# Altium schematic sheet TMTGP_Sensors.SchDoc
size A
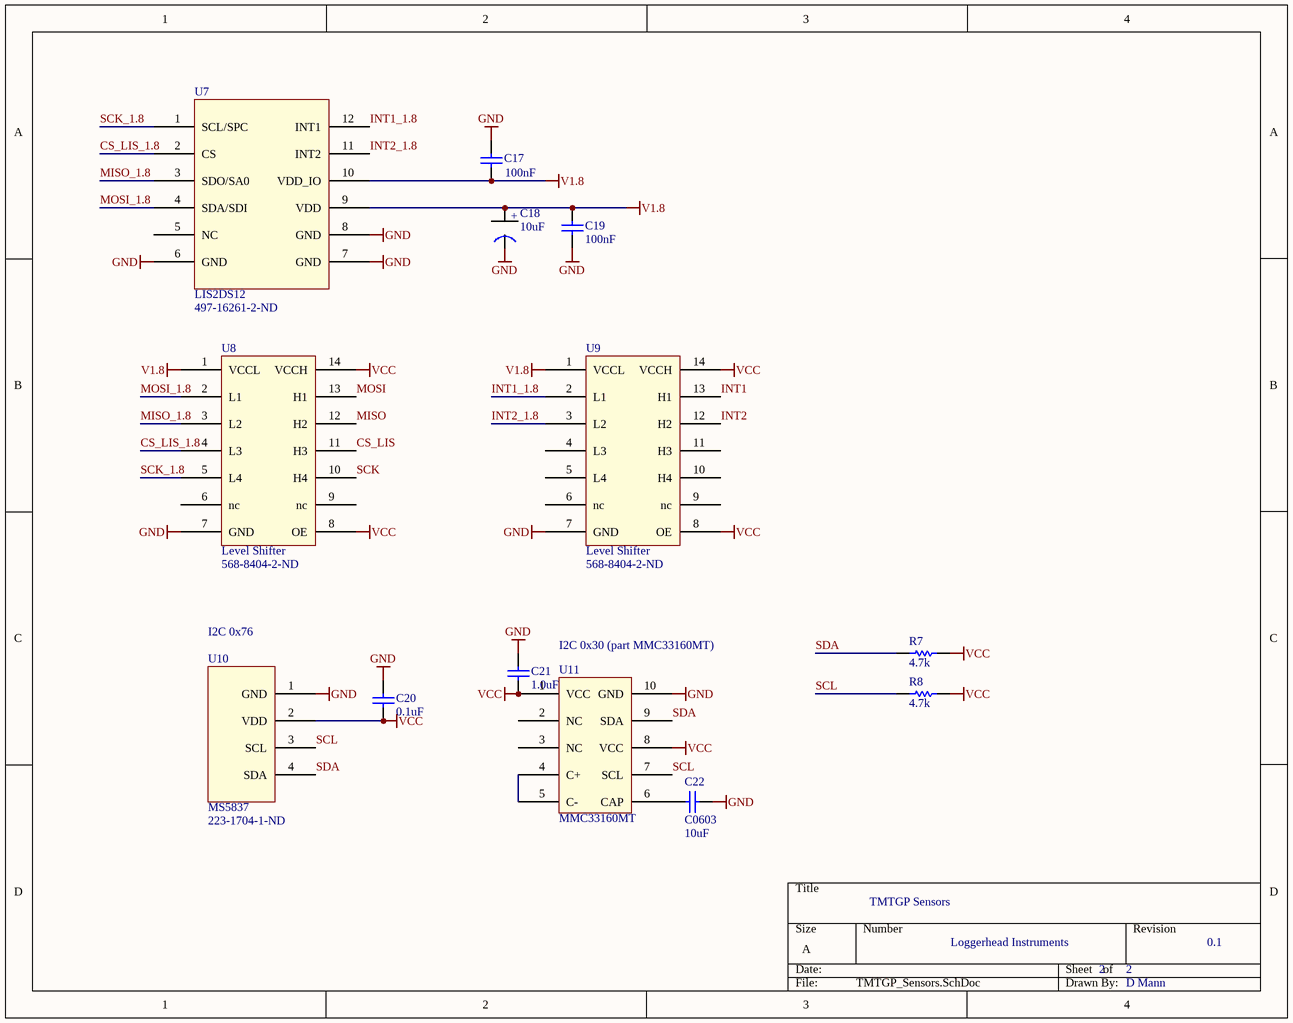
[diagram p0: TMTGP_Sensors.SchDoc]

## Parts
C17  100nF  [0402]
C18  10uF  [Tant0805]
C19  100nF  [0402]
C20  0.1uF  [0402]
C21  1.0uF  [0402]
C22  C0603  value 10uF  [0603]
R7  4.7k  [3-0603]
R8  4.7k  [3-0603]
U7  LIS2DS12  Supplier Part Number 1: 497-16261-2-ND  [LGA-12]
U8  Level Shifter  Supplier Part Number 1: 568-8404-2-ND  [DHVQFN14]
U9  Level Shifter  Supplier Part Number 1: 568-8404-2-ND  [DHVQFN14]
U10  MS5837  Supplier Part Number 1: 223-1704-1-ND  [MS5837]
U11  MMC33160MT  [MMC33160MT]

## Nets
GND: C17.2 C18.1(GND) C19.2 C20.2 C21.2 C22.1 U7.6(GND) U7.7(GND) U7.8(GND) U8.7(GND) U9.7(GND) U10.1(GND) U11.10(GND)
V1.8: C17.1 C18.2(+) C19.1 U7.9(VDD) U7.10(VDD_IO) U8.1(VCCL) U9.1(VCCL)
VCC: C20.1 C21.1 R7.1 R8.2 U8.8(OE) U8.14(VCCH) U9.8(OE) U9.14(VCCH) U10.2(VDD) U11.1(VCC) U11.8(VCC)
CS_LIS: U8.11(H3)
CS_LIS_1.8: U7.2(CS) U8.4(L3)
INT1: U9.13(H1)
INT1_1.8: U7.12(INT1) U9.2(L1)
INT2: U9.12(H2)
INT2_1.8: U7.11(INT2) U9.3(L2)
MISO: U8.12(H2)
MISO_1.8: U7.3(SDO/SA0) U8.3(L2)
MOSI: U8.13(H1)
MOSI_1.8: U7.4(SDA/SDI) U8.2(L1)
SCK: U8.10(H4)
SCK_1.8: U7.1(SCL/SPC) U8.5(L4)
SCL: R8.1 U10.3(SCL) U11.7(SCL)
SDA: R7.2 U10.4(SDA) U11.9(SDA)
NetC22_2: C22.2 U11.6(CAP)
NetU11_4: U11.4(C+) U11.5(C-)

Not connected (* = marked no-connect by the designer): U7 5(NC); U8 6(nc) 9(nc); U9 4(L3) 5(L4) 6(nc) 9(nc) 10(H4) 11(H3); U11 2(NC) 3(NC)

## Notes on the sheet
- I2C 0x76
- I2C 0x30 (part MMC33160MT)
- TMTGP Sensors
- Loggerhead Instruments
- 2
- 0.1
- D Mann

## Library data of the parts
C17 C19 = C0402: Ceramic Chip Capacitor - Standard; Note: Footprint corresponds to dimensions for bulk cassette packaging. This case size has tightened tolerances.; Value: 100pF; Published: 17-Jul-2002; LatestRevisionDate: 19-Mar-2004; LatestRevisionNote: Silkscreen size reduced.; DatasheetDocument: Mar-2001; PackageDocument: Mar-2001; PackageReference: 0402; Publisher: Altium Limited; Code_JEITA: 0402; Code_IPC: 1005 [0402]; ComponentLink1Description: Manufacturer Link; ComponentLink1URL: http://www.kemet.com/; ComponentLink2Description: Datasheet; ComponentLink2URL: http://www.kemet.com/kemet/web/homepage/kechome.nsf/vapubfilesname/F3102TA.pdf/$file/F3102TA.pdf
C18 = Tant0805: Value: 10uF
C20 C21 = C0402: Ceramic Chip Capacitor - Standard; Note: Footprint corresponds to dimensions for bulk cassette packaging. This case size has tightened tolerances.; Published: 17-Jul-2002; LatestRevisionDate: 19-Mar-2004; LatestRevisionNote: Silkscreen size reduced.; DatasheetDocument: Mar-2001; PackageDocument: Mar-2001; PackageReference: 0402; Publisher: Altium Limited; Code_JEITA: 0402; Code_IPC: 1005 [0402]; ComponentLink1Description: Manufacturer Link; ComponentLink1URL: http://www.kemet.com/; ComponentLink2Description: Datasheet; ComponentLink2URL: http://www.kemet.com/kemet/web/homepage/kechome.nsf/vapubfilesname/F3102TA.pdf/$file/F3102TA.pdf
  C20: Value: 0.1uF
  C21: Value: 1.0uF
C22 = C0603: Ceramic Chip Capacitor - Standard; Note: Footprint corresponds to dimensions for bulk cassette packaging. This case size has tightened tolerances.; Published: 17-Jul-2002; LatestRevisionDate: 19-Mar-2004; LatestRevisionNote: Silkscreen size reduced.; DatasheetDocument: Mar-2001; PackageDocument: Mar-2001; PackageReference: 0603; Publisher: Altium Limited; Code_JEITA: 0603; Code_IPC: 1608 [0603]; ComponentLink1Description: Manufacturer Link; ComponentLink1URL: http://www.kemet.com/; ComponentLink2Description: Datasheet; ComponentLink2URL: http://www.kemet.com/kemet/web/homepage/kechome.nsf/vapubfilesname/F3102TA.pdf/$file/F3102TA.pdf
R7 R8 = ERJ3RK: Precision Thick Film Chip Resistor, 10 Ohm to 1M Ohm Range, 1% and 0.5% Tolerance, 0603 Size, 0.063 W; Published: 17-Dec-2003; LatestRevisionDate: 19-Mar-2004; LatestRevisionNote: Silkscreen size reduced.; PackageDocument: Mar-2003; PackageReference: 3-0603; Publisher: Altium Limited; Code_IPC: 1608 [0603]; ComponentLink1Description: Manufacturer Link; ComponentLink1URL: http://www.panasonic.com/industrial/components/resistive_products.htm; ComponentLink2Description: Datasheet; ComponentLink2URL: http://www.panasonic.com/industrial/components/pdf/AOA0000CE2.pdf
U8 U9 = NTB0104: Voltage level translator; Supplier 1: Digi-Key
U10 = MS5837: Pressure/Temp; Supplier 1: Digi-Key
U7 = LIS2DS12: Supplier 1: Digi-Key